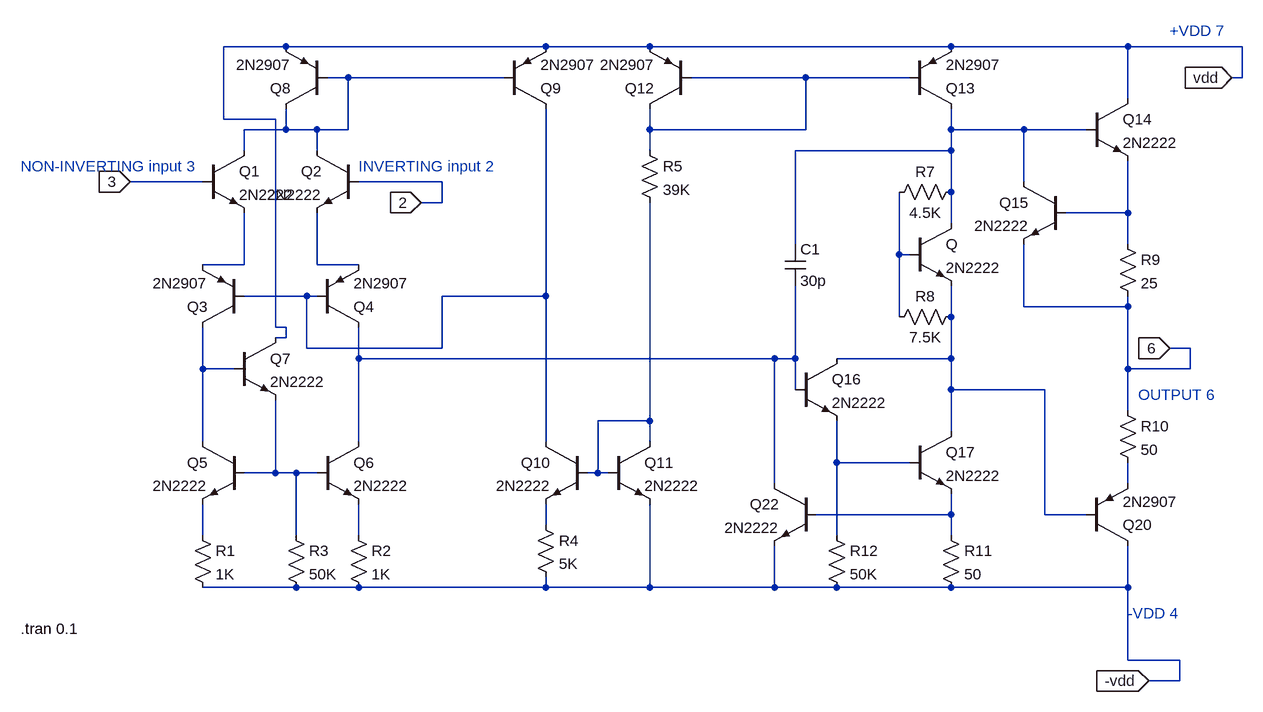
[diagram p0: schematic LM741.asc]
LM741.asc, the LTspice schematic file:
Version 4.1
SHEET 1 1720 952
WIRE 144 -96 48 -96
WIRE 544 -96 144 -96
WIRE 704 -96 544 -96
WIRE 1168 -96 704 -96
WIRE 1440 -96 1168 -96
WIRE 1616 -96 1440 -96
WIRE 240 -48 208 -48
WIRE 480 -48 240 -48
WIRE 944 -48 768 -48
WIRE 1104 -48 944 -48
WIRE 1616 -48 1616 -96
WIRE 1616 -48 1600 -48
WIRE 1440 -16 1440 -96
WIRE 48 16 48 -96
WIRE 128 16 48 16
WIRE 144 32 144 0
WIRE 144 32 80 32
WIRE 192 32 144 32
WIRE 240 32 240 -48
WIRE 240 32 192 32
WIRE 704 32 704 0
WIRE 944 32 944 -48
WIRE 944 32 704 32
WIRE 1168 32 1168 0
WIRE 1280 32 1168 32
WIRE 1376 32 1280 32
WIRE 80 64 80 32
WIRE 192 64 192 32
WIRE 704 64 704 32
WIRE 1168 64 1168 32
WIRE 1168 64 928 64
WIRE 16 112 -96 112
WIRE 384 112 256 112
WIRE 1280 112 1280 32
WIRE 1168 128 1168 64
WIRE 384 144 384 112
WIRE 384 144 352 144
WIRE 1440 160 1440 80
WIRE 1440 160 1344 160
WIRE 1168 176 1168 128
WIRE 928 208 928 64
WIRE 1440 208 1440 160
WIRE 1088 224 1088 128
WIRE 1104 224 1088 224
WIRE 80 240 80 160
WIRE 80 240 16 240
WIRE 192 240 192 160
WIRE 256 240 192 240
WIRE 176 288 80 288
WIRE 192 288 176 288
WIRE 544 288 544 0
WIRE 544 288 384 288
WIRE 1280 304 1280 208
WIRE 1440 304 1440 288
WIRE 1440 304 1280 304
WIRE 1088 320 1088 224
WIRE 1168 320 1168 272
WIRE 128 336 128 16
WIRE 144 336 128 336
WIRE 144 352 144 336
WIRE 144 352 128 352
WIRE 176 368 176 288
WIRE 384 368 384 288
WIRE 384 368 176 368
WIRE 1536 368 1504 368
WIRE 256 384 256 336
WIRE 896 384 256 384
WIRE 928 384 928 272
WIRE 928 384 896 384
WIRE 1168 384 1168 320
WIRE 1168 384 992 384
WIRE 16 400 16 336
WIRE 64 400 16 400
WIRE 1440 400 1440 304
WIRE 1536 400 1536 368
WIRE 1536 400 1440 400
WIRE 928 432 928 384
WIRE 1168 432 1168 384
WIRE 1312 432 1168 432
WIRE 1440 464 1440 400
WIRE 704 480 704 144
WIRE 704 480 624 480
WIRE 1168 496 1168 432
WIRE 16 512 16 400
WIRE 256 512 256 384
WIRE 544 512 544 288
WIRE 704 512 704 480
WIRE 992 544 992 480
WIRE 1104 544 992 544
WIRE 128 560 128 448
WIRE 128 560 80 560
WIRE 160 560 128 560
WIRE 192 560 160 560
WIRE 624 560 624 480
WIRE 624 560 608 560
WIRE 640 560 624 560
WIRE 896 576 896 384
WIRE 1440 576 1440 544
WIRE 1168 624 1168 592
WIRE 1168 624 960 624
WIRE 1312 624 1312 432
WIRE 1376 624 1312 624
WIRE 544 640 544 608
WIRE 16 656 16 608
WIRE 160 656 160 560
WIRE 256 656 256 608
WIRE 992 656 992 544
WIRE 1168 656 1168 624
WIRE 160 736 16 736
WIRE 256 736 160 736
WIRE 544 736 544 720
WIRE 544 736 256 736
WIRE 704 736 704 608
WIRE 704 736 544 736
WIRE 896 736 896 672
WIRE 896 736 704 736
WIRE 992 736 896 736
WIRE 1168 736 992 736
WIRE 1440 736 1440 672
WIRE 1440 736 1168 736
WIRE 1440 848 1440 736
WIRE 1520 848 1440 848
WIRE 1520 880 1520 848
WIRE 1520 880 1472 880
FLAG 352 144 2
IOPIN 352 144 In
FLAG -96 112 3
IOPIN -96 112 In
FLAG 1504 368 6
IOPIN 1504 368 In
FLAG 1600 -48 vdd
IOPIN 1600 -48 In
FLAG 1472 880 -vdd
IOPIN 1472 880 In
SYMBOL npn 16 64 R0
SYMATTR InstName Q1
SYMATTR Value 2N2222
SYMBOL npn 256 64 M0
SYMATTR InstName Q2
SYMATTR Value 2N2222
SYMBOL pnp 208 0 R180
SYMATTR InstName Q8
SYMATTR Value 2N2907
SYMBOL pnp 192 336 M180
SYMATTR InstName Q4
SYMATTR Value 2N2907
SYMBOL pnp 80 336 R180
SYMATTR InstName Q3
SYMATTR Value 2N2907
SYMBOL npn 64 352 R0
SYMATTR InstName Q7
SYMATTR Value 2N2222
SYMBOL npn 80 512 M0
SYMATTR InstName Q5
SYMATTR Value 2N2222
SYMBOL npn 192 512 R0
SYMATTR InstName Q6
SYMATTR Value 2N2222
SYMBOL res 0 640 R0
SYMATTR InstName R1
SYMATTR Value 1K
SYMBOL res 144 640 R0
SYMATTR InstName R3
SYMATTR Value 50K
SYMBOL res 240 640 R0
SYMATTR InstName R2
SYMATTR Value 1K
SYMBOL pnp 480 0 M180
SYMATTR InstName Q9
SYMATTR Value 2N2907
SYMBOL pnp 768 0 R180
SYMATTR InstName Q12
SYMATTR Value 2N2907
SYMBOL res 688 48 R0
SYMATTR InstName R5
SYMATTR Value 39K
SYMBOL npn 608 512 M0
SYMATTR InstName Q10
SYMATTR Value 2N2222
SYMBOL npn 640 512 R0
SYMATTR InstName Q11
SYMATTR Value 2N2222
SYMBOL res 528 624 R0
SYMATTR InstName R4
SYMATTR Value 5K
SYMBOL pnp 1104 0 M180
SYMATTR InstName Q13
SYMATTR Value 2N2907
SYMBOL npn 1104 176 R0
SYMATTR InstName Q
SYMATTR Value 2N2222
SYMBOL cap 912 208 R0
SYMATTR InstName C1
SYMATTR Value 30p
SYMBOL res 1184 112 R90
WINDOW 0 0 56 VBottom 2
WINDOW 3 32 56 VTop 2
SYMATTR InstName R7
SYMATTR Value 4.5K
SYMBOL res 1184 304 R90
WINDOW 0 0 56 VBottom 2
WINDOW 3 32 56 VTop 2
SYMATTR InstName R8
SYMATTR Value 7.5K
SYMBOL npn 928 384 R0
SYMATTR InstName Q16
SYMATTR Value 2N2222
SYMBOL npn 1104 496 R0
SYMATTR InstName Q17
SYMATTR Value 2N2222
SYMBOL npn 960 576 M0
SYMATTR InstName Q22
SYMATTR Value 2N2222
SYMBOL res 976 640 R0
SYMATTR InstName R12
SYMATTR Value 50K
SYMBOL res 1152 640 R0
SYMATTR InstName R11
SYMATTR Value 50
SYMBOL npn 1376 -16 R0
SYMATTR InstName Q14
SYMATTR Value 2N2222
SYMBOL npn 1344 112 M0
SYMATTR InstName Q15
SYMATTR Value 2N2222
SYMBOL res 1424 192 R0
SYMATTR InstName R9
SYMATTR Value 25
SYMBOL res 1424 448 R0
SYMATTR InstName R10
SYMATTR Value 50
SYMBOL pnp 1376 672 M180
SYMATTR InstName Q20
SYMATTR Value 2N2907
TEXT -264 88 Left 2 ;NON-INVERTING input 3
TEXT 256 88 Left 2 ;INVERTING input 2
TEXT 1504 -120 Left 2 ;+VDD 7
TEXT 1440 776 Left 2 ;-VDD 4
TEXT 1456 440 Left 2 ;OUTPUT 6
TEXT -264 800 Left 2 !.tran 0.1

The netlist it stands for:
* LM741.asc
Q1 N001 3 N006 0 2N2222
Q2 N001 2 N007 0 2N2222
Q8 N001 N001 vdd 0 2N2907
Q4 N010 N008 N007 0 2N2907
Q3 N011 N008 N006 0 2N2907
Q7 vdd N011 N014 0 2N2222
Q5 N011 N014 N018 0 2N2222
Q6 N010 N014 N019 0 2N2222
R1 N018 -vdd 1K
R3 N014 -vdd 50K
R2 N019 -vdd 1K
Q9 N008 N001 vdd 0 2N2907
Q12 N002 N002 vdd 0 2N2907
R5 N002 N012 39K
Q10 N008 N012 N017 0 2N2222
Q11 N012 N012 -vdd 0 2N2222
R4 N017 -vdd 5K
Q13 N003 N002 vdd 0 2N2907
Q N003 N005 N009 0 2N2222
C1 N003 N010 30p
R7 N003 N005 4.5K
R8 N009 N005 7.5K
Q16 N009 N010 N013 0 2N2222
Q17 N009 N013 N016 0 2N2222
Q22 N010 N016 -vdd 0 2N2222
R12 N013 -vdd 50K
R11 N016 -vdd 50
Q14 vdd N003 N004 0 2N2222
Q15 N003 N004 6 0 2N2222
R9 N004 6 25
R10 6 N015 50
Q20 -vdd N009 N015 0 2N2907
.model NPN NPN
.model PNP PNP
.lib standard.bjt
* NON-INVERTING input 3
* INVERTING input 2
* +VDD 7
* -VDD 4
* OUTPUT 6
.tran 0.1
.backanno
.end